# Altium schematic sheet 07-FPM_Connector.SchDoc
size A3
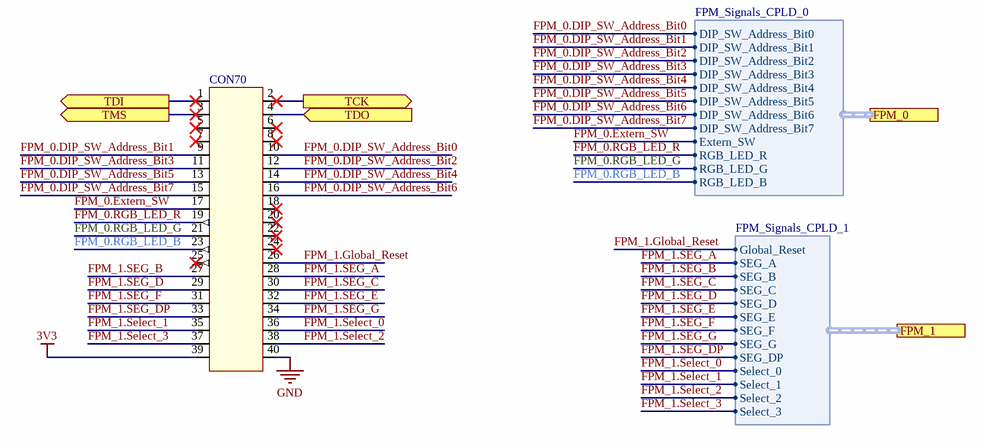
[diagram p0: 07-FPM_Connector.SchDoc]

## Parts
CON70  CON_040_M_2MM54_S_A  [CON_040_THT_2MM54_S_A]  (value not drawn)

## Ports
FPM_0 (harness FPM_Signals_CPLD_0), FPM_1 (harness FPM_Signals_CPLD_1), TCK (out), TDI (out), TDO (in), TMS (out)

## Harnesses
FPM_Signals_CPLD_1: Global_Reset, SEG_A, SEG_B, SEG_C, SEG_D, SEG_DP, SEG_E, SEG_F, SEG_G, Select_0, Select_1, Select_2, Select_3
FPM_Signals_CPLD_0: DIP_SW_Address_Bit0, DIP_SW_Address_Bit1, DIP_SW_Address_Bit2, DIP_SW_Address_Bit3, DIP_SW_Address_Bit4, DIP_SW_Address_Bit5, DIP_SW_Address_Bit6, DIP_SW_Address_Bit7, Extern_SW, RGB_LED_B, RGB_LED_G, RGB_LED_R

## Nets
3V3: CON70.39
GND: CON70.40
FPM_0.DIP_SW_Address_Bit0: CON70.10 ; port FPM_0.DIP_SW_Address_Bit0
FPM_0.DIP_SW_Address_Bit1: CON70.9 ; port FPM_0.DIP_SW_Address_Bit1
FPM_0.DIP_SW_Address_Bit2: CON70.12 ; port FPM_0.DIP_SW_Address_Bit2
FPM_0.DIP_SW_Address_Bit3: CON70.11 ; port FPM_0.DIP_SW_Address_Bit3
FPM_0.DIP_SW_Address_Bit4: CON70.14 ; port FPM_0.DIP_SW_Address_Bit4
FPM_0.DIP_SW_Address_Bit5: CON70.13 ; port FPM_0.DIP_SW_Address_Bit5
FPM_0.DIP_SW_Address_Bit6: CON70.16 ; port FPM_0.DIP_SW_Address_Bit6
FPM_0.DIP_SW_Address_Bit7: CON70.15 ; port FPM_0.DIP_SW_Address_Bit7
FPM_0.Extern_SW: CON70.17 ; port FPM_0.Extern_SW
FPM_0.RGB_LED_B: CON70.23 ; port FPM_0.RGB_LED_B
FPM_0.RGB_LED_G: CON70.21 ; port FPM_0.RGB_LED_G
FPM_0.RGB_LED_R: CON70.19 ; port FPM_0.RGB_LED_R
FPM_1.Global_Reset: CON70.26 ; port FPM_1.Global_Reset
FPM_1.SEG_A: CON70.28 ; port FPM_1.SEG_A
FPM_1.SEG_B: CON70.27 ; port FPM_1.SEG_B
FPM_1.SEG_C: CON70.30 ; port FPM_1.SEG_C
FPM_1.SEG_D: CON70.29 ; port FPM_1.SEG_D
FPM_1.SEG_DP: CON70.33 ; port FPM_1.SEG_DP
FPM_1.SEG_E: CON70.32 ; port FPM_1.SEG_E
FPM_1.SEG_F: CON70.31 ; port FPM_1.SEG_F
FPM_1.SEG_G: CON70.34 ; port FPM_1.SEG_G
FPM_1.Select_0: CON70.36 ; port FPM_1.Select_0
FPM_1.Select_1: CON70.35 ; port FPM_1.Select_1
FPM_1.Select_2: CON70.38 ; port FPM_1.Select_2
FPM_1.Select_3: CON70.37 ; port FPM_1.Select_3
TCK: CON70.2 ; port TCK
TDI: CON70.1 ; port TDI
TDO: CON70.4 ; port TDO
TMS: CON70.3 ; port TMS

Not connected (* = marked no-connect by the designer): CON70 5* 6* 7* 8* 18* 20* 22* 24* 25*

## Notes on the sheet
- Title:
- Date:
- SVN:
- Ver:
- Sheet Size:
- A3
- Sheet Name:
- OF
- Checked By:
- Drawn By:
- Damian Szczypior
- Rev:
- Alle Rechte vorbehalten. Kopien ohne Erlaubnis der X2E GmbH sind nicht gestattet. Dieses Dokument darf ohne die Erlaubnis der X2E GmbH nicht an Dritte (auch nicht in Auszügen) weitergegeben werden .
- Sheet:

## Library data of the parts
CON70 = X_00006869: Connector Header Through Hole 40 position 2.54mm; manufacturer: On Shore Technology Inc.; manufacturer_partnumber: 302-S401; Parameter 3: Digi-Key ED10529-ND; entity_name: CON_040_M_2MM54_S_A_CON HEADER 40 POS; release: blocked; max_operating_temp: 105C; min_operating_temp: -40C; grid: 2MM54; pin_count_type: A; mounting_type: S; gender: M; number_of_electronic_pins: 040; ordering_information_btm: ED10529-ND; used_in_bom: 0; production_status: Aktiv; editor_date: niemiec_14.05.2020; x2e_number: X_00006869; entity_type_name: connector; height: 8mm80; width: 9mm05; length: 58mm4; package: THT; shell_material: Polyester, Glass Filled; features: Connector Header Through Hole 40 position 0.100" (2.54mm); series: 302